# EAGLE design printer (EAGLE 9.2.2)
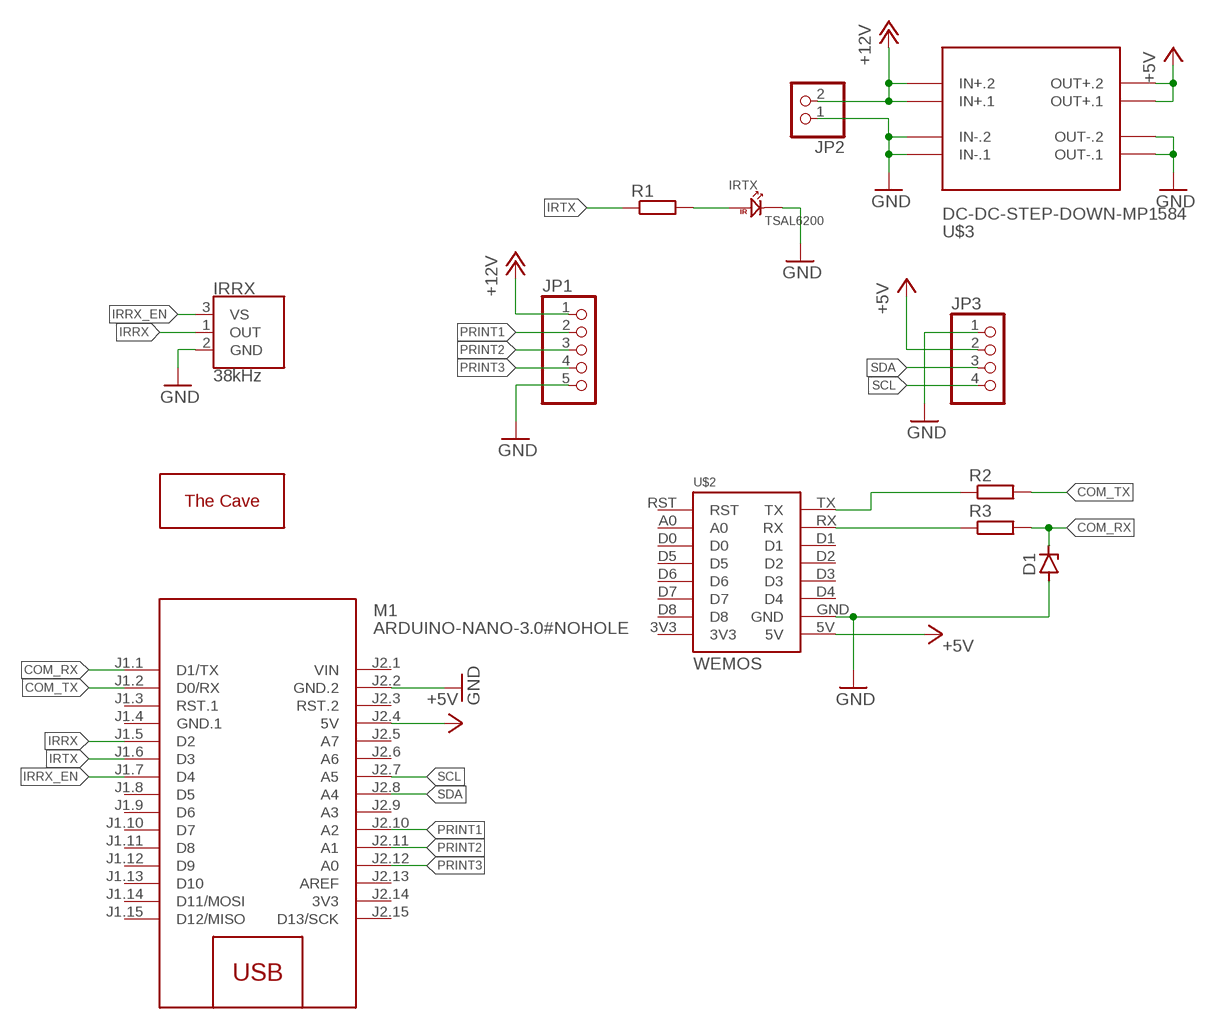
[diagram p0: schematic, sheet 1]

## Parts
D1  ZENER-DIODEDO34-7  [DO34Z7]
IRRX  38kHz  TSOP38238  [TSOP382]
IRTX  TSAL6200  [TSAL6200]
JP1  PINHD-1X5  [1X05]
JP2  PINHD-1X2  [1X02]
JP3  PINHD-1X4  [1X04]
M1  ARDUINO-NANO-3.0#NOHOLE  [ARDUINO-NANO-3.0]
R1  R-EU_0207/7  [0207/7]
R2  R-EU_0207/7  [0207/7]
R3  R-EU_0207/7  [0207/7]
U$2  WEMOS  [WEMOS]
U$3  DC-DC-STEP-DOWN-MP1584  [DC-DC-STEP-DOWN-MP1584]
U$4  THECAVE_LOGO_NEW_BOTTOM  [NEW_LOGO_BOTTOM]

## Nets
+5V: JP3.2 M1.J2.4(5V) U$2.5V U$3.OUT+.1 U$3.OUT+.2
+12V: JP1.1 JP2.2 U$3.IN+.1 U$3.IN+.2
COM_RX: D1.C M1.J1.1(D1/TX) R3.2
COM_TX: M1.J1.2(D0/RX) R2.2
GND: D1.A IRRX.2(GND) IRTX.N JP1.5 JP2.1 JP3.1 M1.J2.2(GND.2) U$2.GND U$3.IN-.1 U$3.IN-.2 U$3.OUT-.1 U$3.OUT-.2
IRRX: IRRX.1(OUT) M1.J1.5(D2)
IRRX_EN: IRRX.3(VS) M1.J1.7(D4)
IRTX: M1.J1.6(D3) R1.1
N$1: R2.1 U$2.TX
N$2: IRTX.P R1.2
N$4: R3.1 U$2.RX
PRINT1: JP1.2 M1.J2.10(A2)
PRINT2: JP1.3 M1.J2.11(A1)
PRINT3: JP1.4 M1.J2.12(A0)
SCL: JP3.4 M1.J2.7(A5)
SDA: JP3.3 M1.J2.8(A4)
Unconnected: M1.J1.3(RST.1) M1.J1.8(D5) M1.J1.9(D6) M1.J1.10(D7) M1.J1.11(D8) M1.J1.12(D9) M1.J1.13(D10) M1.J1.14(D11/MOSI) M1.J1.15(D12/MISO) M1.J2.3(RST.2) M1.J2.5(A7) M1.J2.6(A6) M1.J2.9(A3) M1.J2.13(AREF) M1.J2.15(D13/SCK) U$2.3V3 U$2.A0 U$2.D0 U$2.D1 U$2.D2 U$2.D3 U$2.D4 U$2.D5 U$2.D6 U$2.D7 U$2.D8 U$2.RST

## Power pins joined to a net without a drawn wire
3V3: M1.J2.14(3V3)
GND.1: M1.J1.4(GND.1)
VIN: M1.J2.1(VIN)

## Library data of the parts
D1 = diode:ZENER-DIODE: Z-Diode
IRRX = SparkFun-Sensors:TSOP382: Vishay Semiconductor TSOP32838 - 38kHz IR Receiver These products are miniaturized IR receiver modules for infrared remote control systems. A PIN diode and a preamplifier are assembled on a leadframe, the epoxy package contains an IR filter. The demodulated output signal can be directly connected to a microprocessor for decoding.; PROD_ID: SEN-10266
IRTX = Seeed-OPL-2017-01-Sensor-camilo:TSAL6200: 314020023
JP1 = pinhead:PINHD-1X5: PIN HEADER
JP2 = pinhead:PINHD-1X2: PIN HEADER
JP3 = pinhead:PINHD-1X4: PIN HEADER
M1 = thecave:ARDUINO-NANO-3.0: Arduino Nano 3.0 and compatible devices More details available here: https://www.arduino.cc/en/Main/ArduinoBoardNano Click here to find device on ebay.com <http://www.ebay.com/sch/arduino+nano>
R1-R3 = rcl:R-EU_: RESISTOR, European symbol; SPICEPREFIX: R
U$2 = d1-mini:WEMOS
U$3 = diy-modules:DC-DC-STEP-DOWN-MP1584: DC/DC Step-Down Regulator based on MP1584 chip MP1584 datasheet available here: http://www.haoyuelectronics.com/Attachment/MP1584/MP1584.pdf Click here to find device on ebay.com <http://www.ebay.com/sch/mp1584+module>
U$4 = thecave:THECAVE_LOGO: The Cave DIY workshop logos thecave.cz

## Board
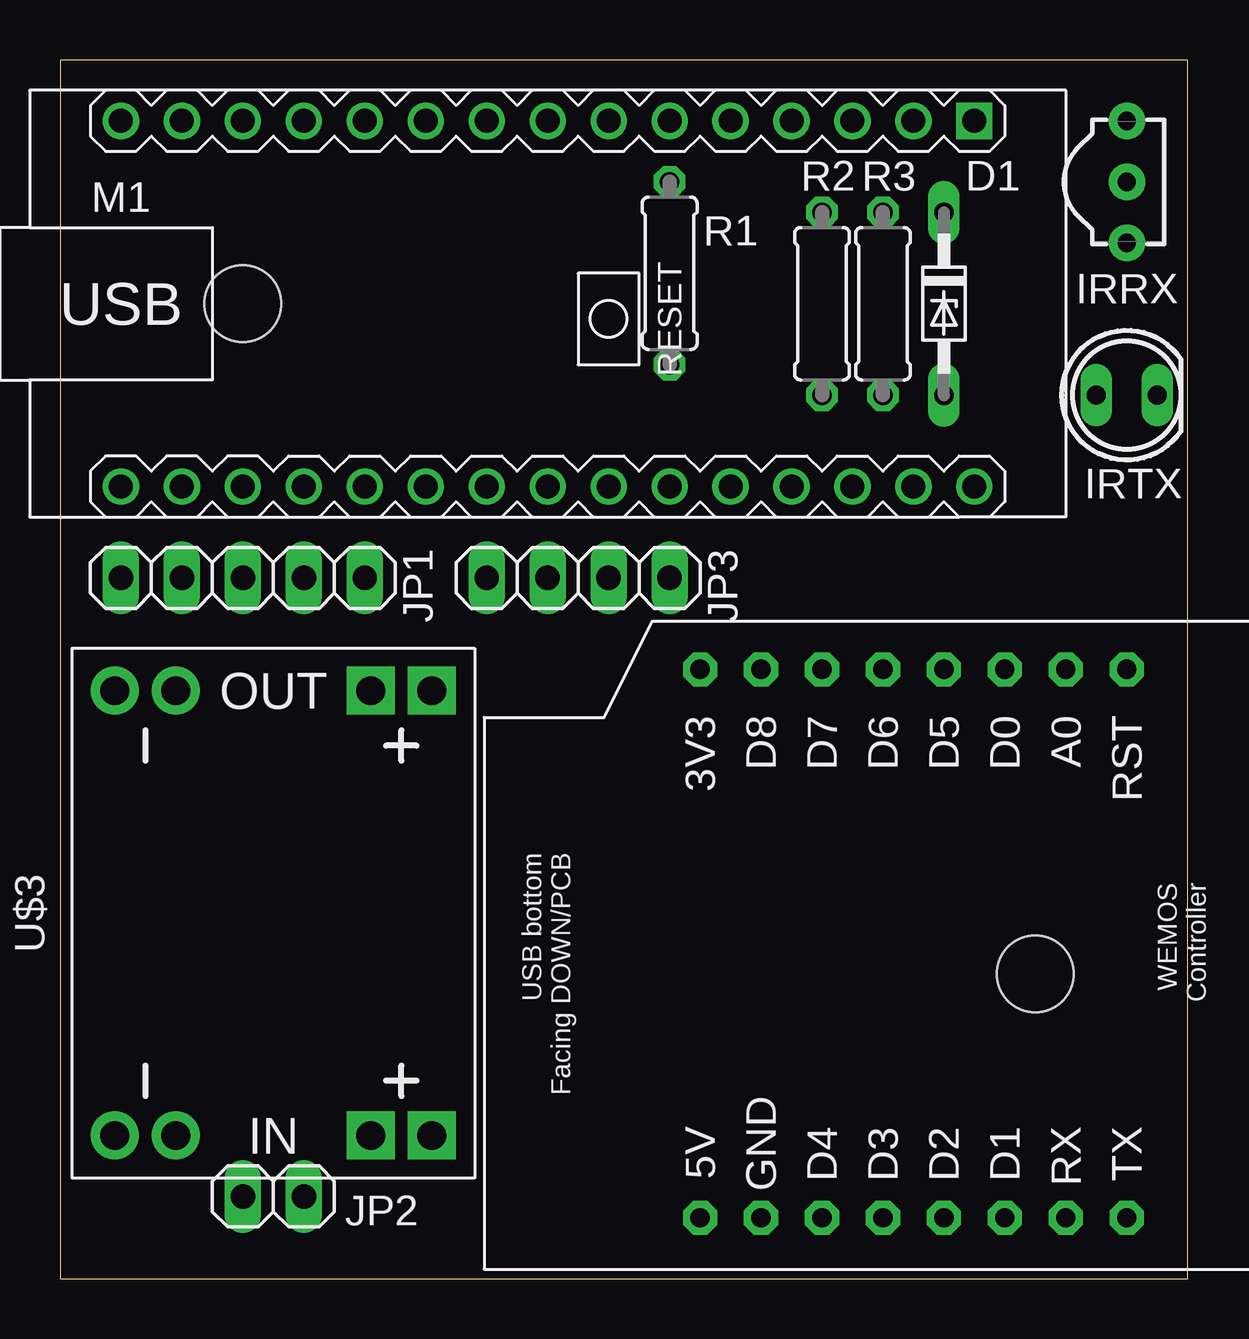
[diagram p1: board, top side]
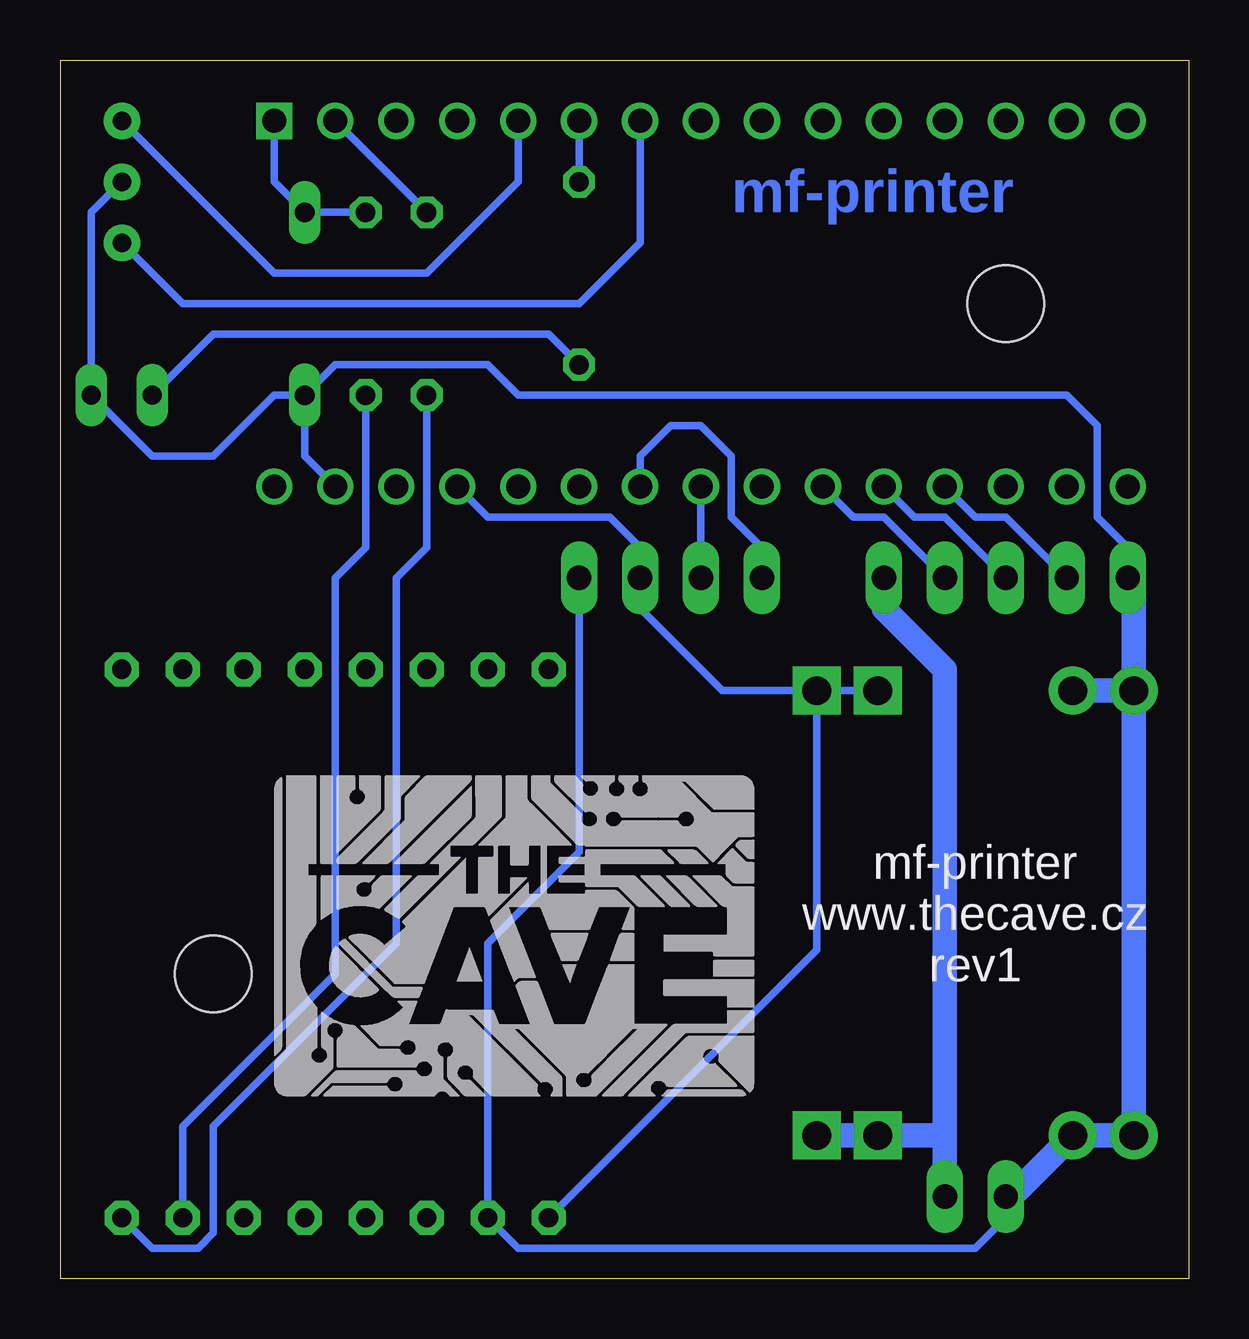
[diagram p2: board, bottom side, seen from below]

Size 46.99 x 50.8 mm. Coordinates in mm from the lower left corner, seen from the top.
Outline: 0,0 46.99,0 46.99,50.8 0,50.8 0,0
Copper layers (1*16): Top 0.035mm / dielectric 1.5mm / Bottom 0.035mm
Design rules "default *": minimum track width 10mil, minimum drill 0.35mm, track to track 10mil, track to pad 10mil, pad to pad 10mil, via to via 10mil, smd to smd 10mil, copper to edge 24mil, drill to drill 10mil, minimum pad ring 10mil, minimum via ring 8mil, stop-mask expansion 4mil, vias tented up to drill 0mil, thermal gap 10mil
Holes 3.2 mm at 7.62,40.64 40.64,12.7

### Footprints (pad centres in the part's own frame; a part is rotated, then mirrored left to right if it is on the bottom)
DO34Z7 = drill 0.813 long: A 3.81,0; C -3.81,0
TSOP382 = drill 0.762 pad 1.524: 1 -2.54,0; 2 0,0; 3 2.54,0
TSAL6200 = drill 0.8 long: N 1.27,0; P -1.27,0
1X05 = drill 1.016 long: 1 -5.08,0; 2 -2.54,0; 3 0,0; 4 2.54,0; 5 5.08,0
1X02 = drill 1.016 long: 1 -1.27,0; 2 1.27,0
1X04 = drill 1.016 long: 1 -3.81,0; 2 -1.27,0; 3 1.27,0; 4 3.81,0
ARDUINO-NANO-3.0 = drill 1 square: J1.1 17.78,7.62 | drill 1: J1.2 15.24,7.62; J1.3 12.7,7.62; J1.4 10.16,7.62; J1.5 7.62,7.62; J1.6 5.08,7.62; J1.7 2.54,7.62; J1.8 0,7.62; J1.9 -2.54,7.62; J1.10 -5.08,7.62; J1.11 -7.62,7.62; J1.12 -10.16,7.62; J1.13 -12.7,7.62; J1.14 -15.24,7.62; J1.15 -17.78,7.62; J2.1 17.78,-7.62; J2.2 15.24,-7.62; J2.3 12.7,-7.62; J2.4 10.16,-7.62; J2.5 7.62,-7.62; J2.6 5.08,-7.62; J2.7 2.54,-7.62; J2.8 0,-7.62; J2.9 -2.54,-7.62; J2.10 -5.08,-7.62; J2.11 -7.62,-7.62; J2.12 -10.16,-7.62; J2.13 -12.7,-7.62; J2.14 -15.24,-7.62; J2.15 -17.78,-7.62
0207/7 = drill 0.813 octagon: 1 -3.81,0; 2 3.81,0
WEMOS = drill 0.8 pad 1.422 octagon: 3V3 0,0; 5V 22.86,0; A0 0,15.24; D0 0,12.7; D1 22.86,12.7; D2 22.86,10.16; D3 22.86,7.62; D4 22.86,5.08; D5 0,10.16; D6 0,7.62; D7 0,5.08; D8 0,2.54; GND 22.86,2.54; RST 0,17.78; RX 22.86,15.24; TX 22.86,17.78
DC-DC-STEP-DOWN-MP1584 = drill 1.2 pad 2 square: IN+.1 -9.271,-4.064; IN+.2 -9.271,-6.604; OUT+.1 9.271,-4.064; OUT+.2 9.271,-6.604 | drill 1.2 pad 2: IN-.1 -9.271,6.604; IN-.2 -9.271,4.064; OUT-.1 9.271,6.604; OUT-.2 9.271,4.064

### Placement (x,y rotation side)
D1  36.83,40.64 270 top
IRRX  44.45,45.72 270 top
IRTX  44.45,36.83 0 top
JP1  7.62,29.21 180 top
JP2  8.89,3.43 0 top
JP3  21.59,29.21 180 top
M1  20.32,40.64 0 top
R1  25.4,41.91 270 top
R2  31.75,40.64 90 top
R3  34.29,40.64 90 top
U$2  26.67,25.4 270 top
U$3  8.89,15.24 90 top
U$4  17.78,7.62 0 top

### Tracks (layer width: path | path; a pad name or v marks a point on that pad's centre or on a via)
+5V
  Bottom 0.305: U$3.OUT+.1 U$3.OUT+.2 | U$2.5V 15.49,13.72 U$3.OUT+.2 | U$3.OUT+.2 19.43,24.51 22.86,27.94 JP3.2 22.86,30.48 24.13,31.75 29.21,31.75 M1.J2.4
+12V
  Bottom 0.305: JP2.2 10.16,4.7
  Bottom 1.016: U$3.IN+.2 U$3.IN+.1 10.16,5.97 | JP1.1 12.7,27.94 10.16,25.4 10.16,5.97 | JP2.2 10.16,5.97
COM_RX
  Bottom 0.305: R3.2 D1.C 38.1,45.72 M1.J1.1
COM_TX
  Bottom 0.305: R2.2 M1.J1.2
GND
  Bottom 0.305: 7.62,2.54 8.89,1.27 27.94,1.27 U$2.GND 29.21,13.97 25.4,17.78 JP3.1 | JP2.1 7.37,3.43 | D1.A 38.1,36.83 40.64,34.29 43.18,34.29 IRTX.N 45.72,44.45 IRRX.2 | M1.J2.2 36.83,34.29 D1.A | D1.A 35.56,38.1 29.21,38.1 27.94,36.83 5.08,36.83 3.81,35.56 3.81,31.75 2.54,30.48 JP1.5
  Bottom 1.016: U$3.OUT-.1 U$3.OUT-.2 | U$3.OUT-.1 U$3.IN-.1 U$3.IN-.2 7.37,3.43 | U$3.OUT-.1 2.29,28.96 JP1.5 | 7.62,2.54 JP2.1
IRRX
  Bottom 0.305: M1.J1.5 27.94,45.72 31.75,41.91 38.1,41.91 IRRX.1
IRRX_EN
  Bottom 0.305: IRRX.3 41.91,40.64 25.4,40.64 22.86,43.18 M1.J1.7
IRTX
  Bottom 0.305: R1.1 M1.J1.6
N$1
  Bottom 0.305: U$2.TX 43.18,1.27 41.27,1.27 40.64,1.91 40.64,6.35 33.02,13.97 33.02,29.21 31.75,30.48 R2.1
N$2
  Bottom 0.305: IRTX.P 40.64,39.37 26.67,39.37 R1.2
N$4
  Bottom 0.305: U$2.RX 41.91,6.35 35.56,12.7 35.56,29.21 34.29,30.48 R3.1
PRINT1
  Bottom 0.305: JP1.2 12.7,31.75 13.97,31.75 M1.J2.10
PRINT2
  Bottom 0.305: JP1.3 10.16,31.75 11.43,31.75 M1.J2.11
PRINT3
  Bottom 0.305: JP1.4 7.62,31.75 8.89,31.75 M1.J2.12
SCL
  Bottom 0.305: JP3.4 17.78,30.48 19.05,31.75 19.05,34.29 20.32,35.56 21.59,35.56 22.86,34.29 M1.J2.7
SDA
  Bottom 0.305: M1.J2.8 JP3.3

### Text on the board
Bottom: mf-printer
bPlace: mf-printer / www.thecave.cz / rev1